# Altium schematic sheet Memory_SRAM.SchDoc
size B; Author: E. Sims; Organization: Let's Build Rockets Inc.; SheetNumber: 5; SheetTotal: 18
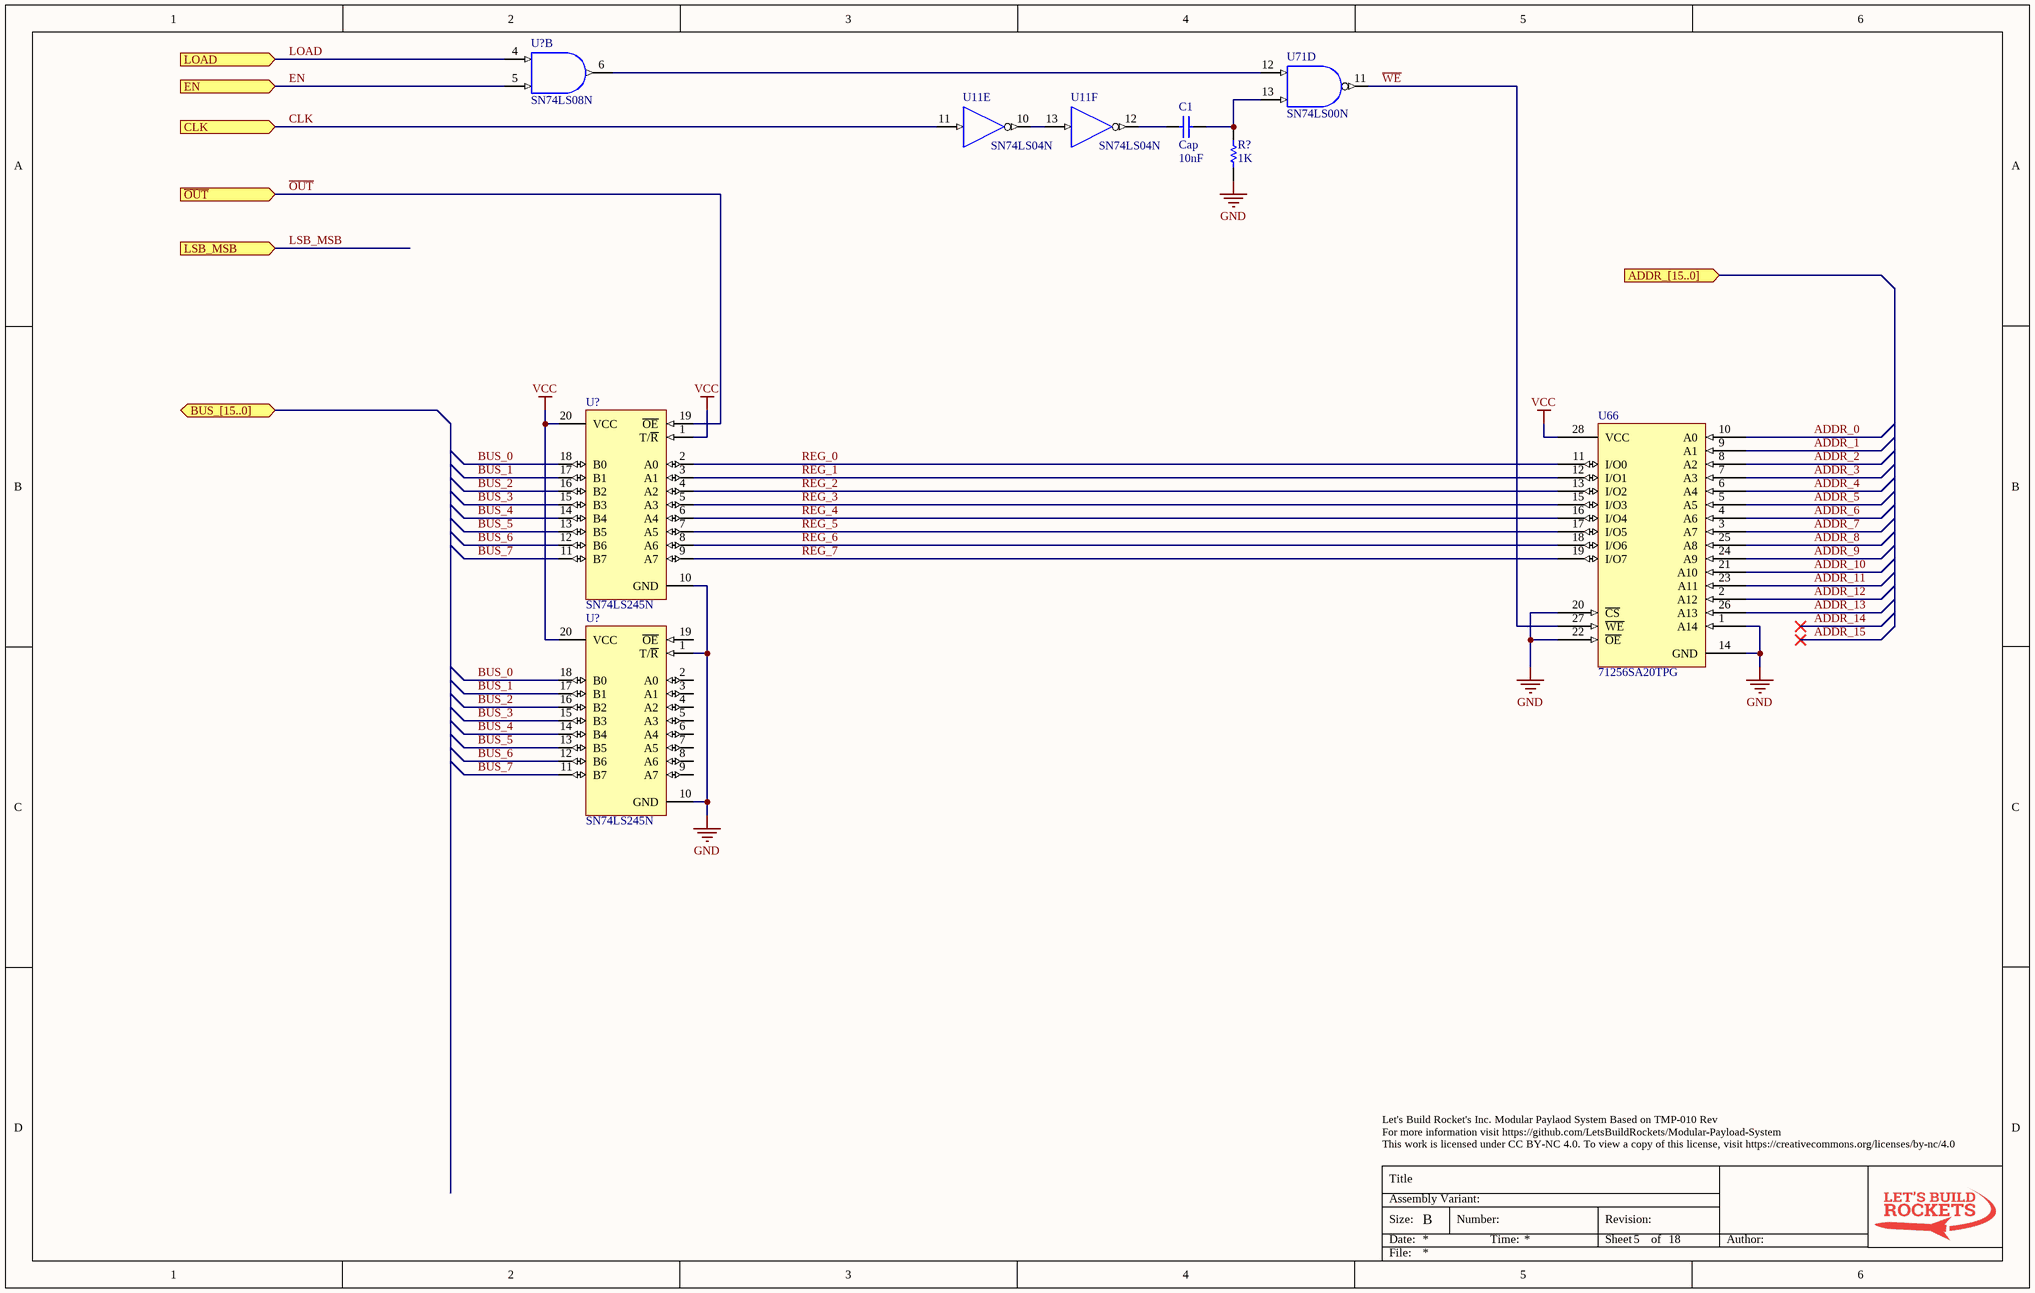
[diagram p0: Memory_SRAM.SchDoc]

## Parts
(Parts that share a designator on the sheet are numbered #1, #2 ... from top to bottom, then left to right.)
C1  Cap  value 10nF  [RAD-0.3]
R?  value 1K  [AXIAL-0.3]  (hidden comment: Res1)
U11  SN74LS04N  [N014]  (parts E,F of 6)
U66  71256SA20TPG  [JT028]
U71  SN74LS00N  [N014]  (part D of 4)
U?#1  SN74LS08N  [N014]  (part B of 4)
U?#2  SN74LS245N  [N020]
U?#3  SN74LS245N  [N020]

## Ports
ADDR_[15..0] (in), BUS_[15..0] (bidir), CLK (in), EN (in), LOAD (in), LSB_MSB (in), ~{OUT} (in)

## Nets
GND: R?.1 U11.7(GND) U66.1(A14) U66.14(GND) U66.20(~{CS}) U66.22(~{OE}) U71.7(GND) U?#1.7(GND) U?#2.10(GND) U?#3.1(T/~{R}) U?#3.10(GND)
VCC: U11.14(VCC) U66.28(VCC) U71.14(VCC) U?#1.14(VCC) U?#2.1(T/~{R}) U?#2.20(VCC) U?#3.20(VCC)
ADDR_0: U66.10(A0)
ADDR_1: U66.9(A1)
ADDR_2: U66.8(A2)
ADDR_3: U66.7(A3)
ADDR_4: U66.6(A4)
ADDR_5: U66.5(A5)
ADDR_6: U66.4(A6)
ADDR_7: U66.3(A7)
ADDR_8: U66.25(A8)
ADDR_9: U66.24(A9)
ADDR_10: U66.21(A10)
ADDR_11: U66.23(A11)
ADDR_12: U66.2(A12)
ADDR_13: U66.26(A13)
BUS_0: U?#2.18(B0) U?#3.18(B0)
BUS_1: U?#2.17(B1) U?#3.17(B1)
BUS_2: U?#2.16(B2) U?#3.16(B2)
BUS_3: U?#2.15(B3) U?#3.15(B3)
BUS_4: U?#2.14(B4) U?#3.14(B4)
BUS_5: U?#2.13(B5) U?#3.13(B5)
BUS_6: U?#2.12(B6) U?#3.12(B6)
BUS_7: U?#2.11(B7) U?#3.11(B7)
CLK: U11.11(A) ; port CLK
EN: U?#1.5(B) ; port EN
LOAD: U?#1.4(A) ; port LOAD
LSB_MSB: port LSB_MSB
~{OUT}: U?#2.19(~{OE}) ; port ~{OUT}
REG_0: U66.11(I/O0) U?#2.2(A0)
REG_1: U66.12(I/O1) U?#2.3(A1)
REG_2: U66.13(I/O2) U?#2.4(A2)
REG_3: U66.15(I/O3) U?#2.5(A3)
REG_4: U66.16(I/O4) U?#2.6(A4)
REG_5: U66.17(I/O5) U?#2.7(A5)
REG_6: U66.18(I/O6) U?#2.8(A6)
REG_7: U66.19(I/O7) U?#2.9(A7)
~{WE}: U66.27(~{WE}) U71.11(Y)
NetC1_1: C1.1 R?.2 U71.13(B)
NetC1_2: C1.2 U11.12(Y)
NetU11_10: U11.10(Y) U11.13(A)
NetU71_12: U71.12(A) U?#1.6(Y)

Not connected (* = marked no-connect by the designer): U?#3 2(A0) 3(A1) 4(A2) 5(A3) 6(A4) 7(A5) 8(A6) 9(A7) 19(~{OE})

## Notes on the sheet
- Let's Build Rocket's Inc. Modular Paylaod System Based on TMP-010 Rev
  For more information visit https://github.com/LetsBuildRockets/Modular-Payload-System
  This work is licensed under CC BY-NC 4.0. To view a copy of this license, visit https://creativecommons.org/licenses/by-nc/4.0
- Title
- Size:
- Date:
- Assembly Variant:
- B
- Number:
- Time:
- Revision:
- Sheet
- of
- Author:
- File:

## Library data of the parts
C1 = Cap: Capacitor; Published: 8-Jun-2000; LatestRevisionDate: 17-Jul-2002; LatestRevisionNote: Re-released for DXP Platform.; PackageReference: RAD-0.3; Publisher: Altium Limited; PackageDescription: Radial Cap, Thru-Hole; 2 Leads; 0.3 in Pin Spacing
R? = Res1: Resistor; Published: 8-Jun-2000; LatestRevisionDate: 17-Jul-2002; LatestRevisionNote: Re-released for DXP Platform.; PackageReference: AXIAL-0.3; Publisher: Altium Limited; PackageDescription: Axial Device, Thru-Hole; 2 Leads; 0.3 in Pin Spacing
U11 = SN74LS04N: Hex Inverter; Published: 8-Jun-2000; LatestRevisionDate: 04-Mar-2005; LatestRevisionNote: Stylized 3D Model Added.; DatasheetVersion: Mar-1988; PackageVersion: Oct-1995; PackageReference: N014; Publisher: Altium Limited; PackageDescription: DIP; 14 Leads; Row Spacing 7.62 mm; Pitch 2.54 mm; ComponentLink1Description: Manufacturer Link; ComponentLink1URL: http://www.ti.com/; ComponentLink2Description: Datasheet; ComponentLink2URL: http://www-s.ti.com/sc/ds/sn74ls04.pdf
U71 = SN74LS00N: Quadruple 2-Input Positive-NAND Gate; Published: 8-Jun-2000; LatestRevisionDate: 04-Mar-2005; LatestRevisionNote: Stylized 3D Model Added.; DatasheetVersion: Mar-1988; PackageVersion: Oct-1995; PackageReference: N014; Publisher: Altium Limited; PackageDescription: DIP; 14 Leads; Row Spacing 7.62 mm; Pitch 2.54 mm; ComponentLink1Description: Manufacturer Link; ComponentLink1URL: http://www.ti.com/; ComponentLink2Description: Datasheet; ComponentLink2URL: http://www-s.ti.com/sc/ds/sn74ls00.pdf
U?#1 = SN74LS08N: Quadruple 2-Input Positive-AND Gate; Published: 8-Jun-2000; LatestRevisionDate: 04-Mar-2005; LatestRevisionNote: Stylized 3D Model Added.; DatasheetVersion: Mar-1988; PackageVersion: Oct-1995; PackageReference: N014; Publisher: Altium Limited; PackageDescription: DIP; 14 Leads; Row Spacing 7.62 mm; Pitch 2.54 mm; ComponentLink1Description: Manufacturer Link; ComponentLink1URL: http://www.ti.com/; ComponentLink2Description: Datasheet; ComponentLink2URL: http://www-s.ti.com/sc/ds/SN74LS08.pdf
U?#2 U?#3 = SN74LS245N: Octal Bus Transceiver with 3-State Outputs; Published: 8-Jun-2000; LatestRevisionDate: 04-Mar-2005; LatestRevisionNote: Stylized 3D Model Added.; DatasheetVersion: Mar-1988; PackageVersion: Oct-1995; PackageReference: N020; Publisher: Altium Limited; PackageDescription: DIP; 20 Leads; Row Spacing 7.62 mm; Pitch 2.54 mm; ComponentLink1Description: Manufacturer Link; ComponentLink1URL: http://www.ti.com/; ComponentLink2Description: Datasheet; ComponentLink2URL: http://www-s.ti.com/sc/ds/sn74ls245.pdf